# EAGLE design control-board (EAGLE 9.6.2)
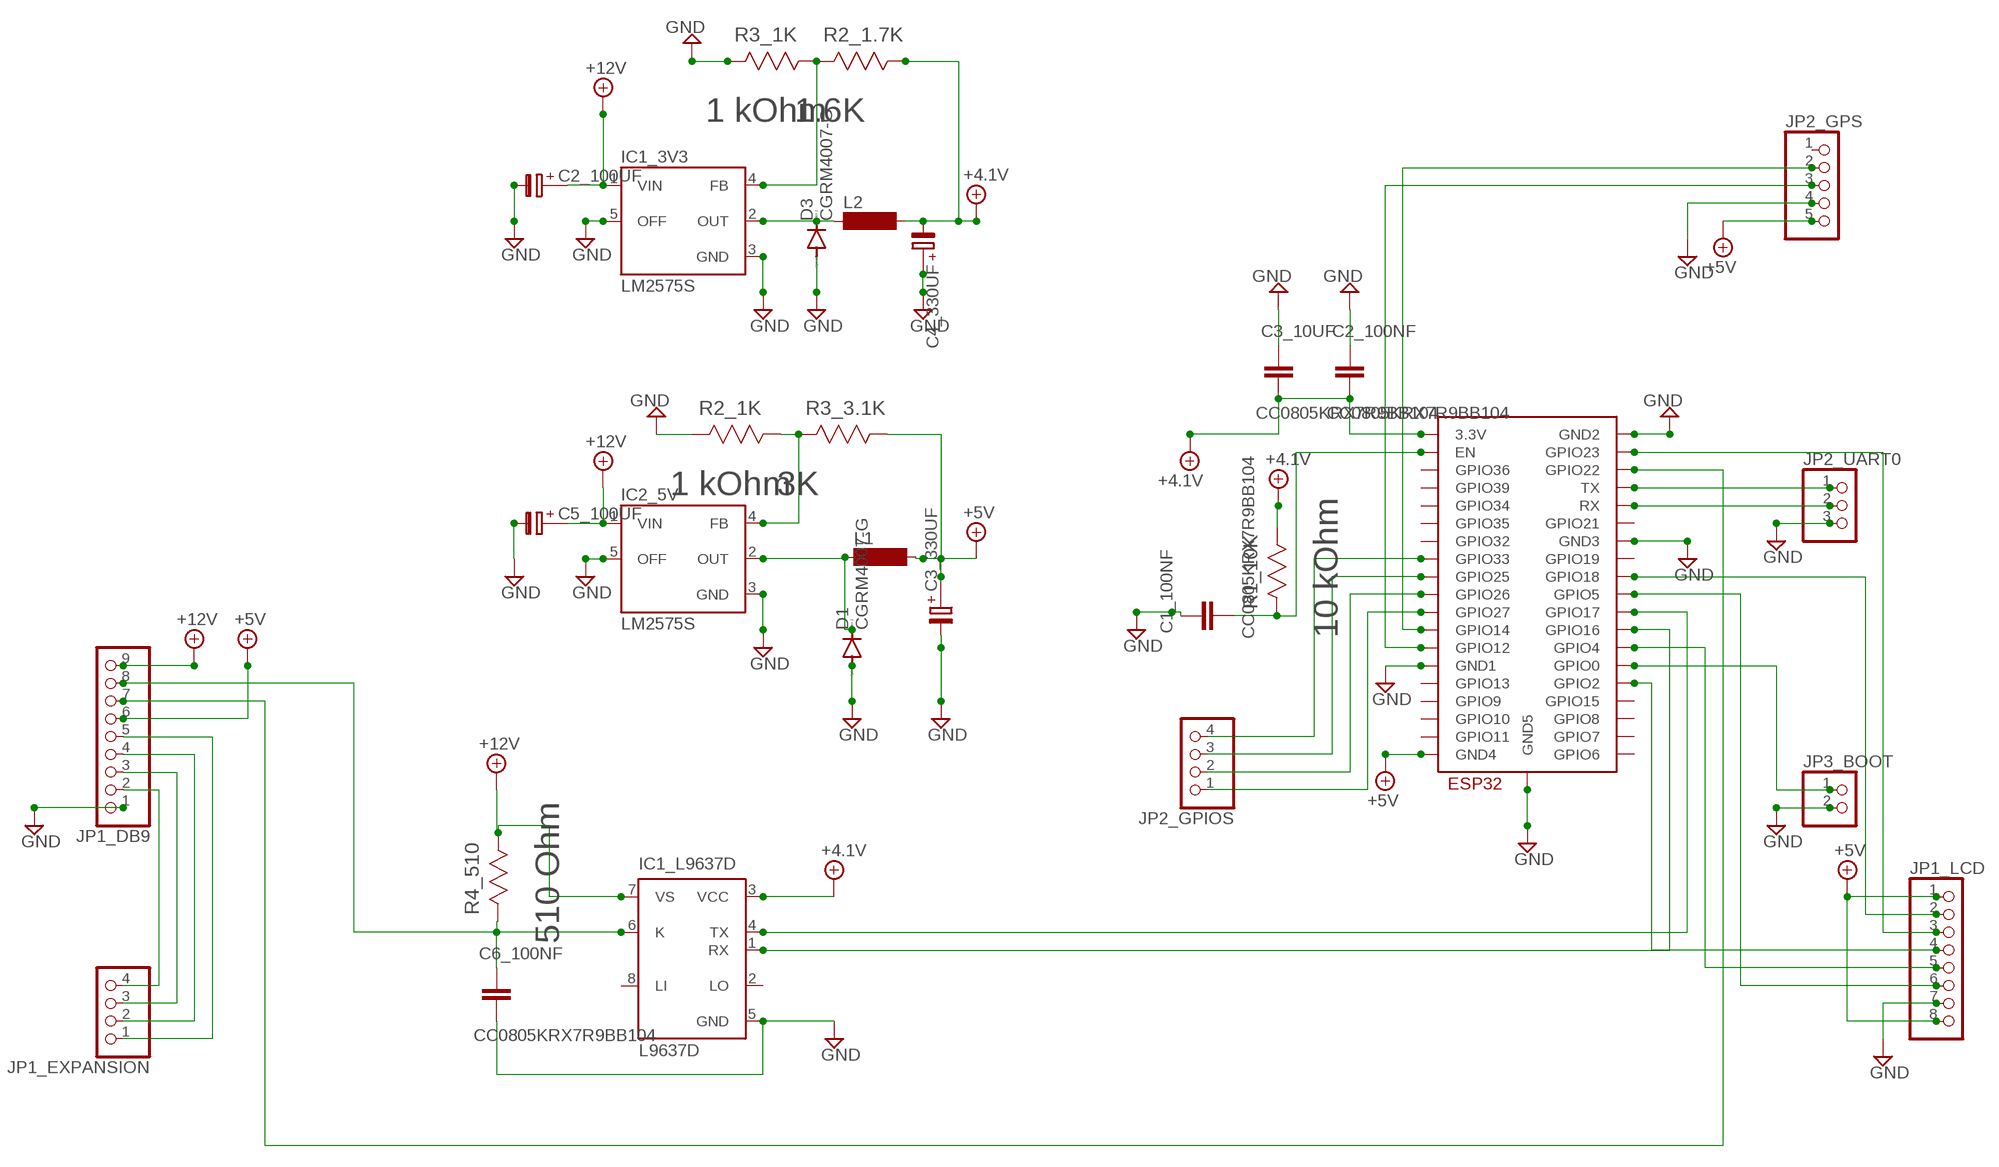
[diagram p0: schematic, sheet 1]

## Parts
C1_100NF  CC0805KRX7R9BB104  [CAP_0805]
C2_100NF  CC0805KRX7R9BB104  [CAP_0805]
C2_100UF  C-PR-SMD-SV-E/F  [SV-E/F]
C3_10UF  CC0805KRX7R9BB104  [CAP_0805]
C3_330UF  C-PR-SMD-SV-D  [SV-D]
C4_330UF  C-PR-SMD-SV-D  [SV-D]
C5_100UF  C-PR-SMD-SV-E/F  [SV-E/F]
C6_100NF  CC0805KRX7R9BB104  [CAP_0805]
D1  CGRM4007-G  [SOD-123_MINI-SMA]
D3  CGRM4007-G  [SOD-123_MINI-SMA]
ESP32  ESP32-WROOM  [ESP32-WROOM]
IC1_3V3  LM2575S  [TO263-5]
IC1_L9637D  L9637D  [SO08]
IC2_5V  LM2575S  [TO263-5]
JP1_DB9  PINHD-1X9/90  [1X09/90]
JP1_EXPANSION  PINHD-1X4/90  [1X04/90]
JP1_LCD  PINHD-1X8  [1X08]
JP2_GPIOS  PINHD-1X4/90  [1X04/90]
JP2_GPS  PINHD-1X5  [1X05]
JP2_UART0  PINHD-1X3/90  [1X03/90]
JP3_BOOT  PINHD-1X2/90  [1X02/90]
L1  MS85  [MS85]
L2  MS85  [MS85]
R1_10K  10 kOhm  ERA-6AEB103V  [RESC2013X65N]
R2_1.7K  1.6K  ERJP06F1601V  [RESC2013X65N]
R2_1K  1 kOhm  ERA-6AEB102V  [RESC2013X65N]
R3_1K  1 kOhm  ERA-6AEB102V  [RESC2013X65N]
R3_3.1K  3K  ERJP06F3001V  [RESC2013X65N]
R4_510  510 Ohm  ERA-6AEB511V  [RESC2013X65N]

## Nets
+4.1V: C2_100NF.2 C3_10UF.2 C4_330UF.- ESP32.3V3(3.3V) IC1_L9637D.3(VCC) L2.2 R1_10K.1(R1) R2_1.7K.1(R1)
+5V: C3_330UF.+ ESP32.GND4 JP1_DB9.6 JP1_LCD.1 JP1_LCD.8 JP2_GPS.5 L1.2 R3_3.1K.1(R1)
+12V: C2_100UF.+ C5_100UF.+ IC1_3V3.1(VIN) IC1_L9637D.7(VS) IC2_5V.1(VIN) JP1_DB9.9 R4_510.1(R1)
GND: C1_100NF.1 C2_100NF.1 C2_100UF.- C3_10UF.1 C3_330UF.- C4_330UF.+ C5_100UF.- C6_100NF.2 D1.A D3.A ESP32.GND1 ESP32.GND2 ESP32.GND3 ESP32.GND5 IC1_3V3.3(GND) IC1_3V3.5(OFF) IC1_L9637D.5(GND) IC2_5V.3(GND) IC2_5V.5(OFF) JP1_DB9.1 JP1_LCD.7 JP2_GPS.4 JP2_UART0.3 JP3_BOOT.2 R2_1K.2(R2) R3_1K.2(R2)
N$1: C1_100NF.2 ESP32.EN R1_10K.2(R2)
N$2: D3.C IC1_3V3.2(OUT) L2.1
N$3: C6_100NF.1 IC1_L9637D.6(K) JP1_DB9.8 R4_510.2(R2)
N$4: D1.C IC2_5V.2(OUT) L1.1
N$5: IC1_3V3.4(FB) R2_1.7K.2(R2) R3_1K.1(R1)
N$6: ESP32.IO0(GPIO0) JP3_BOOT.1
N$7: ESP32.TX JP2_UART0.1
N$8: ESP32.RX JP2_UART0.2
N$9: IC2_5V.4(FB) R2_1K.1(R1) R3_3.1K.2(R2)
N$10: ESP32.IO22(GPIO22) JP1_DB9.7
N$11: JP1_DB9.2 JP1_EXPANSION.4
N$12: ESP32.IO17(GPIO17) IC1_L9637D.4(TX)
N$13: ESP32.IO16(GPIO16) IC1_L9637D.1(RX)
N$14: ESP32.IO12(GPIO12) JP2_GPS.3
N$15: ESP32.IO14(GPIO14) JP2_GPS.2
N$16: JP1_DB9.3 JP1_EXPANSION.3
N$17: JP1_DB9.4 JP1_EXPANSION.2
N$18: JP1_DB9.5 JP1_EXPANSION.1
N$19: ESP32.IO5(GPIO5) JP1_LCD.6
N$20: ESP32.IO4(GPIO4) JP1_LCD.5
N$21: ESP32.IO2(GPIO2) JP1_LCD.4
N$22: ESP32.IO23(GPIO23) JP1_LCD.3
N$23: ESP32.IO18(GPIO18) JP1_LCD.2
N$24: ESP32.IO27(GPIO27) JP2_GPIOS.1
N$25: ESP32.IO26(GPIO26) JP2_GPIOS.2
N$26: ESP32.IO25(GPIO25) JP2_GPIOS.3
N$27: ESP32.IO33(GPIO33) JP2_GPIOS.4
Unconnected: ESP32.CLK(GPIO6) ESP32.CMD(GPIO11) ESP32.IO13(GPIO13) ESP32.IO15(GPIO15) ESP32.IO19(GPIO19) ESP32.IO21(GPIO21) ESP32.IO32(GPIO32) ESP32.IO34(GPIO34) ESP32.IO35(GPIO35) ESP32.SD0(GPIO7) ESP32.SD1(GPIO8) ESP32.SD2(GPIO9) ESP32.SD3(GPIO10) ESP32.SENSOR_VN(GPIO39) ESP32.SENSOR_VP(GPIO36) IC1_L9637D.2(LO) IC1_L9637D.8(LI) JP2_GPS.1

## Library data of the parts
C1_100NF C2_100NF C3_10UF C6_100NF = Resistor_Capacitor:CC0805KRX7R9BB104: CAP CER 0.1UF 50V X7R 0805 Manufacturer's datasheet <http://www.yageo.com/documents/recent/UPY-GPHC_X7R_6.3V-to-50V_18.pdf>; CREATED_BY: PCBLayout.com; DIGIKEY_PART_NUMBER: 311-1140-2-ND; MANUFACTURER: Yageo; MPN: CC0805KRX7R9BB104; PACKAGE: SMD 0805
C2_100UF C3_330UF C4_330UF C5_100UF = cap-pan40:C-PR: POLARIZED ELECTROLYTIC/TANTALUM
D1 D3 = diode:CGRM400*-G: Molded plasitc,JEDEC SOD-123/Mini SMA Source: Comchip CGRM4001-G.pdf
ESP32 = ESP32:ESP32-WROOM
IC1_3V3 IC2_5V = v-reg-3:LM2575: National Semiconductor <http://www.national.com> 1.0A "Simple Switcher"(c) 52kHz, Vout 1.23-37V (HV: 57V), Vin 40V (HV: 60V), 50µA standby current
IC1_L9637D = st-microelectronics:L9637D: ISO 9141 INTERFACE Source: 1765.pdf; MPN: L9637D; OC_FARNELL: unknown; OC_NEWARK: 56P8926
JP1_DB9 = pinhead:PINHD-1X9: PIN HEADER
JP1_EXPANSION JP2_GPIOS = pinhead:PINHD-1X4: PIN HEADER
JP1_LCD = pinhead:PINHD-1X8: PIN HEADER
JP2_GPS = pinhead:PINHD-1X5: PIN HEADER
JP2_UART0 = pinhead:PINHD-1X3: PIN HEADER
JP3_BOOT = pinhead:PINHD-1X2: PIN HEADER
L1 L2 = inductor-neosid:MS85: INDUCTOR SMD power inductor; OC_FARNELL: unknown; OC_NEWARK: unknown
R1_10K = Panasonic_By_element14_Batch_1:ERA-6AEB103V: RESISTOR, 0805; MPN: ERA-6AEB103V; OC_FARNELL: 1811404; OC_NEWARK: 08N2142; SUPPLIER: Panasonic; TOLERANCE: ±0.1 %; WATTAGE: 0.125 W
R2_1.7K = Panasonic_By_element14_Batch_1:ERJP06F1601V: RESISTOR, 0805; MPN: ERJP06F1601V; OC_FARNELL: 1894187; OC_NEWARK: 55T5739; SUPPLIER: Panasonic; TOLERANCE: ± 1%; WATTAGE: .25W
R2_1K R3_1K = Panasonic_By_element14_Batch_1:ERA-6AEB102V: RESISTOR, 0805; MPN: ERA-6AEB102V; OC_FARNELL: 1811415; OC_NEWARK: 08N2141; SUPPLIER: Panasonic; TOLERANCE: ±0.1 %; WATTAGE: 0.125 W
R3_3.1K = Panasonic_By_element14_Batch_1:ERJP06F3001V: RESISTOR, 0805; MPN: ERJP06F3001V; OC_FARNELL: 1894190; OC_NEWARK: 55T5754; SUPPLIER: Panasonic; TOLERANCE: ± 1%; WATTAGE: .25W
R4_510 = Panasonic_By_element14_Batch_1:ERA-6AEB511V: RESISTOR, 0805; MPN: ERA-6AEB511V; OC_FARNELL: 1670224; OC_NEWARK: 40P0028; SUPPLIER: Panasonic; TOLERANCE: ±0.1 %; WATTAGE: 0.125 W

## Board
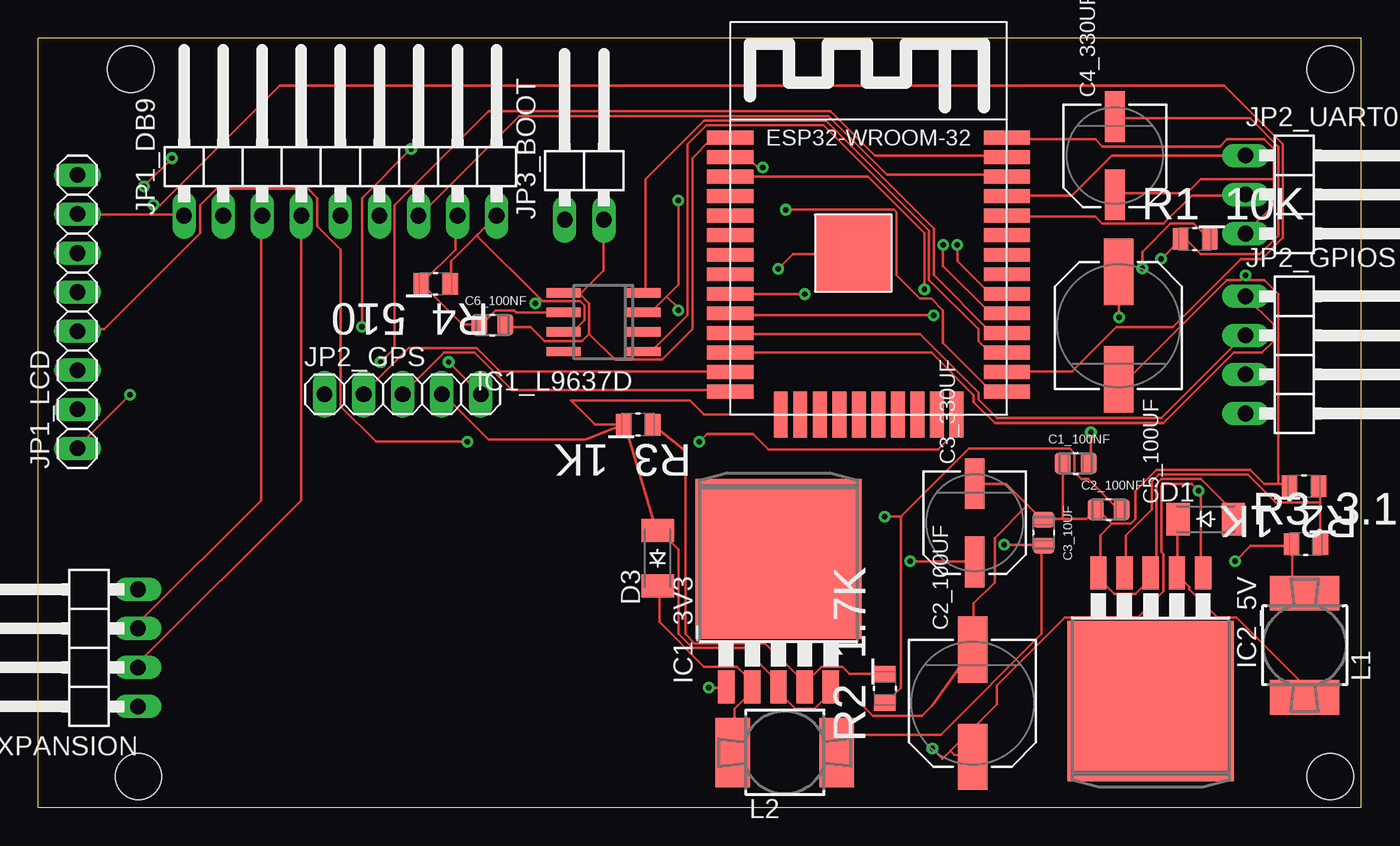
[diagram p1: board, top side]
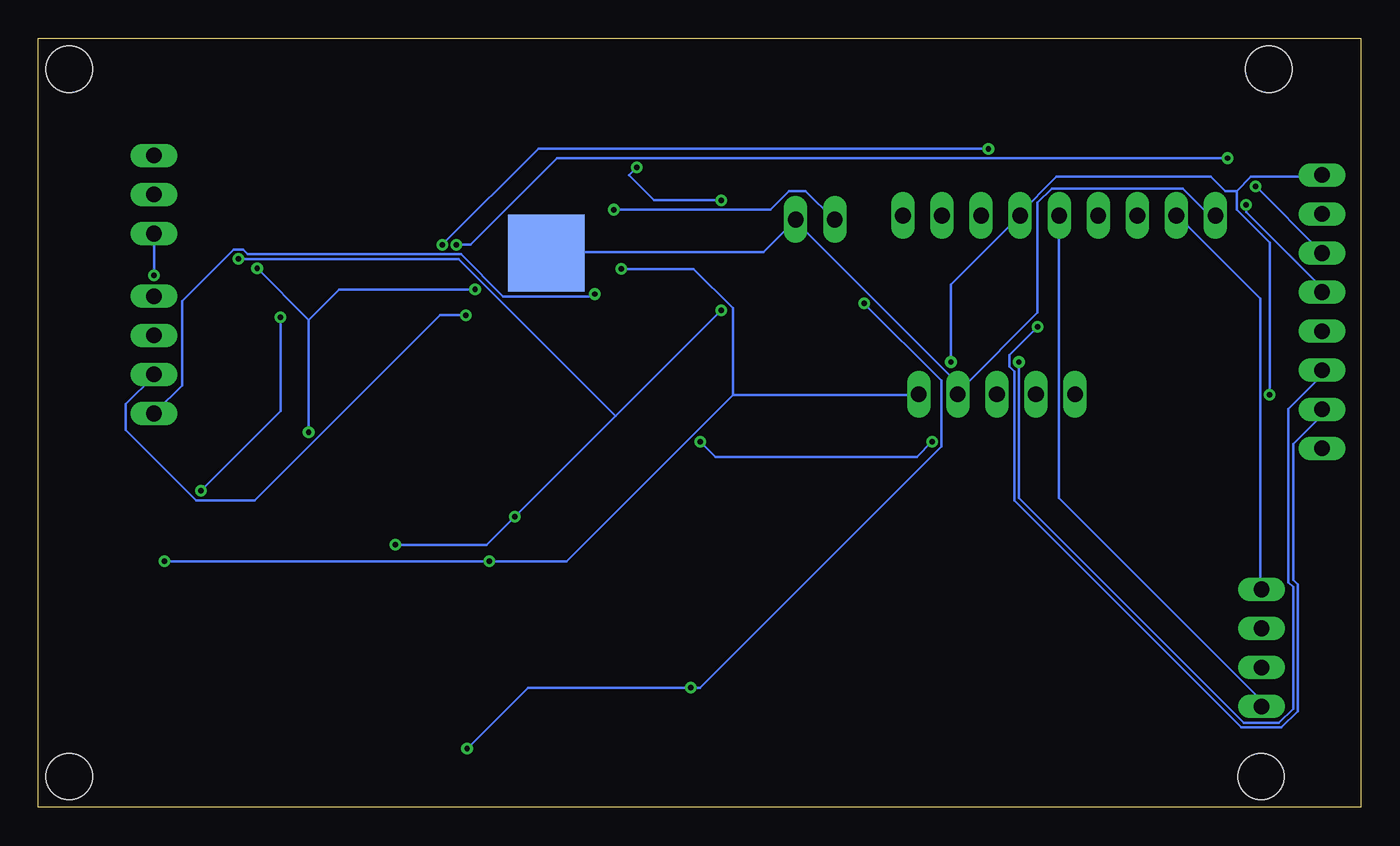
[diagram p2: board, bottom side, seen from below]

Size 86 x 50 mm. Coordinates in mm from the lower left corner, seen from the top.
Outline: 0,0 86,0 86,50 0,50 0,0
Copper layers (1*16): Top 0.035mm / dielectric 1.5mm / Bottom 0.035mm
Design rules "default": minimum track width 6mil, minimum drill 0.35mm, track to track 6mil, track to pad 6mil, pad to pad 6mil, via to via 6mil, smd to smd 6mil, copper to edge 40mil, drill to drill 6mil, minimum pad ring 10mil, minimum via ring 8mil, stop-mask expansion 4mil, vias tented up to drill 0mil, thermal gap 10mil
Holes 3 mm at 6,48 6.5,2 84,48 84,2

### Footprints (pad centres in the part's own frame; a part is rotated, then mirrored left to right if it is on the bottom)
CAP_0805 = smd 1.05 x 1.38: 1 -0.84,0; 2 0.84,0
SV-E/F = smd 4.318 x 1.93: + -3.493,0; - 3.493,0
SV-D = smd 3.302 x 1.27: + -2.54,0; - 2.54,0
SOD-123_MINI-SMA = smd 1.5 x 2.1: A 1.8,0; C -1.8,0
ESP32-WROOM = smd 3 x 0.9: 3V3 0,16.74; EN 0,15.47; GND1 0,18.01; GND3 18,18.01; IO0 18,1.5; IO4 18,2.77; IO5 18,6.58; IO12 0,1.5; IO14 0,2.77; IO16 18,4.04; IO17 18,5.31; IO18 18,7.85; IO19 18,9.12; IO21 18,11.66; IO22 18,15.47; IO23 18,16.74; IO25 0,6.58; IO26 0,5.31; IO27 0,4.04; IO32 0,9.12; IO33 0,7.85; IO34 0,11.66; IO35 0,10.39; NC 18,10.39; RX 18,12.93; SENSOR_VN 0,12.93; SENSOR_VP 0,14.2; TX 18,14.2 | smd 0.9 x 3: CLK 9.635,0; CMD 8.365,0; GND2 3.285,0; IO2 14.715,0; IO13 4.555,0; IO15 13.445,0; SD0 10.905,0; SD1 12.175,0; SD2 5.825,0; SD3 7.095,0 | smd 5 x 5: GND4 8,10.5 | smd 5 x 5 bottom: GND5 8,10.5
TO263-5 = smd 1.067 x 2.159: 1 -3.404,-5.791; 2 -1.702,-5.791; 3 0,-5.791; 4 1.702,-5.791; 5 3.404,-5.791 | smd 10.8 x 10.41: 6 0,2.54
SO08 = smd 0.6 x 2.2: 1 -1.905,-2.6; 2 -0.635,-2.6; 3 0.635,-2.6; 4 1.905,-2.6; 5 1.905,2.6; 6 0.635,2.6; 7 -0.635,2.6; 8 -1.905,2.6
1X09/90 = drill 1.016 long: 1 -10.16,-3.81; 2 -7.62,-3.81; 3 -5.08,-3.81; 4 -2.54,-3.81; 5 0,-3.81; 6 2.54,-3.81; 7 5.08,-3.81; 8 7.62,-3.81; 9 10.16,-3.81
1X04/90 = drill 1.016 long: 1 -3.81,-3.81; 2 -1.27,-3.81; 3 1.27,-3.81; 4 3.81,-3.81
1X08 = drill 1.016 long: 1 -8.89,0; 2 -6.35,0; 3 -3.81,0; 4 -1.27,0; 5 1.27,0; 6 3.81,0; 7 6.35,0; 8 8.89,0
1X05 = drill 1.016 long: 1 -5.08,0; 2 -2.54,0; 3 0,0; 4 2.54,0; 5 5.08,0
1X03/90 = drill 1.016 long: 1 -2.54,-3.81; 2 0,-3.81; 3 2.54,-3.81
1X02/90 = drill 1.016 long: 1 -1.27,-3.81; 2 1.27,-3.81
MS85 = smd 4.5 x 2.25: 1 0,-3.383; 2 0,3.383
RESC2013X65N = smd 1.016 x 1.397: 1 -0.94,0; 2 0.94,0

### Placement (x,y rotation side)
C1_100NF  67.44,22.36 0 top
C2_100NF  69.58,19.36 0 top
C2_100UF  60.74,6.77 90 top
C3_10UF  65.36,17.85 270 top
C3_330UF  60.88,18.5 90 top
C4_330UF  69.99,42.37 90 top
C5_100UF  70.23,31.32 270 top
C6_100NF  29.51,31.36 0 top
D1  75.9,18.74 0 top
D3  40.26,16.2 90 top
ESP32  44.98,25.54 0 top
IC1_3V3  48.12,13.62 0 top
IC1_L9637D  36.74,31.55 90 top
IC2_5V  72.32,9.44 180 top
JP1_DB9  19.63,42.29 0 top
JP1_EXPANSION  2.65,10.36 90 top
JP1_LCD  2.53,32.23 90 top
JP2_GPIOS  82.29,29.42 270 top
JP2_GPS  23.68,26.86 0 top
JP2_UART0  82.29,39.85 270 top
JP3_BOOT  35.49,42.03 0 top
L1  82.33,10.53 0 top
L2  48.53,3.56 270 top
R1_10K  75.2,36.96 0 top
R2_1.7K  55.04,7.73 90 top
R2_1K  82.29,20.88 180 top
R3_1K  38.99,24.88 180 top
R3_3.1K  82.41,17.12 0 top
R4_510  25.83,34.04 180 top

### Tracks (layer width: path | path; a pad name or v marks a point on that pad's centre or on a via)
+4.1V  (via drill 0.35)
  Top 0.152: L2.2 51.97,3.66 53.03,4.72 58.67,4.72 65.23,11.28 65.23,16.92 C3_10UF.2 65.23,17.07 v62.79,17.07 | C4_330UF.- 70.1,44.81 78.79,44.81 80.62,42.98 80.62,37.19 79.4,35.97 75.59,35.97 74.68,36.88 74.37,36.88 R1_10K.1 74.22,36.88 v73,35.66 | 40.84,33.22 41.6,33.98 v41.6,39.47 | 40.84,33.22 39.93,32.31 39.47,32.31 IC1_L9637D.3 | v47.09,41.6 46.79,41.6 46.18,42.22 45.11,42.22 ESP32.3V3 | 56.08,18.9 60.5,23.32 67.06,23.32 67.36,23.01 67.36,21.79 67.82,21.34 68.28,21.34 70.1,19.51 70.41,19.51 C2_100NF.2 | 56.08,18.9 56.08,7.77 55.17,6.86 R2_1.7K.1 | 40.84,33.22 41.6,32.46 v41.6,32.31 | 56.08,18.9 v55.02,18.9
  Bottom 0.152: v41.6,39.47 45.96,39.47 47.59,41.1 v47.09,41.6 | 48.46,25.45 v55.02,18.9 56.84,17.07 v62.79,17.07 | 48.46,25.45 v41.6,32.31 | v73,35.66 58.67,35.66 48.46,25.45
+5V  (via drill 0.35)
  Top 0.152: 81.53,17 81.53,14.78 82.3,14.02 L1.2 | 81.53,17 81.53,17.07 R3_3.1K.1 | v26.67,28.96 28.65,26.98 JP2_GPS.5 | v56.69,16 60.81,16 C3_330UF.+ | v77.81,16 78.81,17 81.53,17 | v48.09,35.01 49.05,35.97 52.88,35.97 ESP32.GND4 | v5.94,26.82 2.59,23.47 JP1_LCD.1
  Bottom 0.152: v26.67,28.96 26.67,33.98 22.25,38.41 JP1_DB9.6 22.25,38.56 19.81,41 9.75,41 8.84,40.08 8.08,40.08 | 40.84,26.82 51.66,16 v56.69,16 v77.81,16 | 40.84,26.82 28.8,26.82 JP2_GPS.5 | v48.09,35.01 43.39,35.01 40.84,32.46 40.84,26.82 | v5.94,26.82 5.94,36.73 8.08,38.86 8.08,40.08 | 8.08,40.08 7.16,41 2.59,41 JP1_LCD.8
+12V  (via drill 0.35)
  Top 0.152: 28.5,37.19 29.72,38.41 JP1_DB9.9 | 28.5,37.19 26.82,35.51 26.82,34.14 R4_510.1 | 28.5,37.19 32.61,33.07 | 32.61,33.07 32.77,32.92 35.2,32.92 35.51,32.61 35.51,31.7 34.75,30.94 34.29,30.94 IC1_L9637D.7 | v43.59,7.77 44.65,7.77 IC1_3V3.1 | 59.28,3.66 59.54,3.4 C2_100UF.+ | 59.28,3.66 58.78,3.16 v58.13,3.81 | 59.28,3.66 62.33,6.71 62.33,7.92 66.75,12.34 71.48,12.34 73.15,14.02 73.15,16.46 73,16.61 73,20.88 73.15,21.03 74.98,21.03 v75.44,20.57 75.59,20.42 75.59,15.24 IC2_5V.1 | v70.26,31.85 70.26,34.75 C5_100UF.+ | v32.31,32.77 32.61,33.07
  Bottom 0.152: v58.13,3.81 54.17,7.77 v43.59,7.77 42.98,7.77 27.28,23.47 27.28,27.74 v32.31,32.77 | v70.26,31.85 70.26,25.76 v75.44,20.57
GND  (via drill 0.35)
  Top 0.152: 80.31,40.84 80.31,39.17 78.49,37.34 JP2_UART0.3 | 80.31,40.84 80.31,42.82 79.7,43.43 77.27,43.43 76.81,42.98 69.19,42.98 68.73,43.43 63.09,43.43 ESP32.GND3 | 80.31,40.84 75.59,40.84 74.68,39.93 70.1,39.93 C4_330UF.+ | D1.A 76.94,19.5 77.11,19.81 75.59,21.34 73,21.34 72.69,21.03 72.69,15.54 72.39,15.24 IC2_5V.3 72.24,15.09 72.24,14.78 71.32,13.87 69.95,13.87 69.04,14.78 69.04,15.09 IC2_5V.5 69.04,15.24 69.04,17.68 69.8,18.44 | 66.6,18.75 68.12,18.75 C2_100NF.1 68.89,19.36 69.8,18.44 | 66.6,18.75 65.38,18.75 C3_10UF.1 65.23,18.75 64.31,19.66 | 66.6,18.75 66.6,22.25 C1_100NF.1 | 80.62,21.03 79.7,21.03 78.79,21.95 72.69,21.95 71.32,20.57 71.32,18.75 71.02,18.44 69.8,18.44 | 80.62,21.03 81.23,21.03 R2_1K.2 | 64.31,19.66 62.94,21.03 60.96,21.03 C3_330UF.- | 80.62,21.03 80.62,33.38 79.7,34.29 78.49,34.29 78.33,34.44 | C5_100UF.- 70.26,27.89 70.87,27.89 77.27,34.29 78.18,34.29 78.33,34.44 | 64.31,19.66 62.18,17.53 62.18,14.63 60.81,13.26 60.81,10.3 C2_100UF.- 58.14,6.63 57.45,5.94 54.25,5.94 52.43,7.77 51.66,7.77 IC1_3V3.5 51.51,7.77 51.51,7.47 50.44,6.4 49.23,6.4 48.16,7.47 48.16,7.77 IC1_3V3.3 48.01,7.92 48.01,8.23 45.87,10.36 42.52,10.36 41.6,11.28 41.6,16.76 40.39,17.98 D3.A 40.23,18.14 40.08,18.29 38.19,24.74 R3_1K.2 | 35.81,30.79 35.36,30.33 32.92,30.33 32,31.24 30.48,31.24 C6_100NF.2 | 35.81,30.79 35.81,32.77 35.2,33.38 | 35.2,33.38 34.29,33.38 IC1_L9637D.5 35.2,33.38 | 35.81,30.79 37.49,29.11 40.54,29.11 42.52,31.09 42.52,42.22 43.74,43.43 44.96,43.43 ESP32.GND1 | 35.2,33.38 36.73,34.9 36.73,38.1 JP3_BOOT.2 | ESP32.GND2 43.27,25.54 42.35,26.45 34.62,26.45 36.19,24.88 R3_1K.2
  Top 0.152: JP2_GPS.4 26.36,26.82 29.26,23.93 35.58,23.93 R3_1K.2 | JP1_LCD.7 2.59,38.56 9.45,38.56 JP1_DB9.1 | 78.33,34.44 v78.49,34.59
  Bottom 0.152: v78.49,34.59 78.49,37.19 JP2_UART0.3 | ESP32.GND5 52.88,36.12 38.86,36.12 36.88,38.1 JP3_BOOT.2 36.73,38.1 25.91,27.28 | 2.59,38.56 JP1_LCD.7 | 9.45,38.56 JP1_DB9.1 9.6,38.56 9.91,38.56 11.58,40.23 20.12,40.23 21.03,39.32 21.03,32.16 25.91,27.28 | 25.91,27.28 26.21,26.98 JP2_GPS.4 25.91,27.28
N$1  (via drill 0.35)
  Top 0.152: v68.43,24.38 68.43,22.4 C1_100NF.2 | v71.78,35.05 71.78,36.12 73.61,37.95 75.13,37.95 76.05,37.03 R1_10K.2 | v57.61,33.68 57.61,37.34 53.95,41 45.11,41 ESP32.EN
  Bottom 0.152: 68.43,31.7 v68.43,24.38 | v71.78,35.05 68.43,31.7 | v57.61,33.68 66.45,33.68 68.43,31.7
N$2
  Top 0.152: D3.C 40.39,14.33 40.39,12.04 43.28,9.14 45.41,9.14 46.33,8.23 46.33,7.92 IC1_3V3.2 46.33,7.77 46.33,7.47 45.26,6.4 45.26,3.66 L2.1
N$3
  Top 0.152: IC1_L9637D.6 34.14,32.16 31.09,32.16 30.94,32.31 29.72,32.31 28.8,31.39 C6_100NF.1 28.65,31.39 27.58,31.39 24.99,33.98 R4_510.2 24.99,34.14 27.13,36.27 27.13,38.41 JP1_DB9.8
N$4
  Top 0.152: D1.C 74.07,18.66 74.07,15.24 IC2_5V.2 74.07,15.09 74.83,14.33 74.83,14.17 76.66,12.34 77.88,12.34 82.3,7.92 82.3,7.16 L1.1
N$5
  Top 0.152: 49.84,8.08 49.68,7.92 IC1_3V3.4 49.84,8.08 | 49.84,8.08 50.9,9.14 52.27,9.14 52.73,8.69 55.02,8.69 R2_1.7K.2 | 49.84,8.08 47.24,10.67 42.67,10.67 42.06,11.28 42.06,23.18 R3_1K.1
N$6  (via drill 0.35)
  Top 0.152: v48.59,38.86 55.63,38.86 55.78,38.71 55.78,34.59 57.3,33.07 58.06,33.07 58.83,32.31 58.83,30.18 61.87,27.13 62.94,27.13 ESP32.IO0
  Bottom 0.152: v48.59,38.86 38.41,38.86 37.19,40.08 36.12,40.08 34.29,38.25 JP3_BOOT.1
N$7
  Top 0.152: ESP32.TX 63.09,39.78 67.21,39.78 69.8,42.37 78.33,42.37 JP2_UART0.1
N$8
  Top 0.152: ESP32.RX 63.09,38.41 68.73,38.41 69.19,37.95 73.15,37.95 74.98,39.78 78.33,39.78 JP2_UART0.2
N$9
  Top 0.152: 83.36,19.81 83.36,20.88 R2_1K.1 | 83.36,19.81 83.36,17.22 R3_3.1K.2 | 83.36,19.81 80.47,19.81 78.64,21.64 72.85,21.64 72.39,21.18 72.39,19.36 70.71,17.68 70.71,15.24 IC2_5V.4
N$10
  Top 0.152: ESP32.IO22 62.94,41.15 55.17,41.15 51.36,44.96 31.24,44.96 24.84,38.56 JP1_DB9.7
N$11
  Bottom 0.152: JP1_EXPANSION.4 6.55,14.17 6.55,33.07 11.89,38.41 JP1_DB9.2
N$12
  Top 0.152: IC1_L9637D.4 39.47,33.53 39.47,40.84 43.28,44.65 51.21,44.65 58.22,37.64 58.22,34.59 61.87,30.94 62.94,30.94 ESP32.IO17
N$13
  Top 0.152: IC1_L9637D.1 39.47,29.72 39.93,29.72 42.22,32 42.22,43.13 43.43,44.35 51.05,44.35 57.91,37.49 57.91,34.29 61.11,31.09 61.11,30.33 61.72,29.72 62.94,29.72 ESP32.IO16
N$14
  Top 0.152: ESP32.IO12 44.96,27.13 30.79,27.13 28.35,29.57 26.36,29.57 23.77,26.98 JP2_GPS.3
N$15
  Top 0.152: ESP32.IO14 44.96,28.35 30.02,28.35 28.5,29.87 24.08,29.87 21.18,26.98 JP2_GPS.2
N$16
  Top 0.152: JP1_EXPANSION.3 6.55,11.73 6.55,12.04 14.48,19.96 14.48,38.41 JP1_DB9.3
N$17
  Top 0.152: JP1_EXPANSION.2 6.55,9.14 6.55,9.45 17.07,19.96 17.07,38.41 JP1_DB9.4
N$18
  Bottom 0.152: JP1_EXPANSION.1 6.55,6.55 6.55,7.01 19.66,20.12 19.66,38.41 JP1_DB9.5
N$19  (via drill 0.35)
  Top 0.152: v58.83,36.58 58.83,35.2 61.87,32.16 62.94,32.16 ESP32.IO5 | v8.69,42.22 v6.86,40.39
  Bottom 0.152: v58.83,36.58 57.91,36.58 52.27,42.22 v8.69,42.22 | v6.86,40.39 2.59,36.12 JP1_LCD.6
N$20  (via drill 0.35)
  Top 0.152: ESP32.IO4 63.09,28.35 67.21,28.35 70.1,31.24 73.76,31.24 78.18,35.66 79.55,35.66 80.92,37.03 80.92,43.13 77.11,46.94 15.7,46.94 7.92,39.17 v7.47,39.17 | 2.34,33.59 JP1_LCD.5
  Bottom 0.152: v7.47,39.17 7.47,38.71 2.59,33.83 2.59,33.53 JP1_LCD.5
N$21  (via drill 0.35)
  Top 0.152: v42.98,23.77 43.48,24.27 46.48,24.27 47.48,23.27 58.48,23.27 59.59,24.38 59.59,25.45 ESP32.IO2 | v27.89,23.77 21.95,23.77 19.66,26.06 19.66,36.27 18.14,37.8 18.14,39.62 17.53,40.23 11.58,40.23 10.52,39.17 10.52,37.34 4.27,31.09 2.59,31.09 JP1_LCD.4
  Bottom 0.152: v27.89,23.77 28.89,22.77 41.98,22.77 v42.98,23.77
N$22  (via drill 0.35)
  Top 0.152: v22.25,28.96 23.16,29.87 23.16,39.17 29.26,45.26 51.51,45.26 54.41,42.37 62.94,42.37 ESP32.IO23
  Bottom 0.152: v22.25,28.96 22.25,20.12 7.62,5.49 5.33,5.49 4.42,6.4 4.42,14.33 4.72,14.63 4.72,25.91 2.59,28.04 2.59,28.35 JP1_LCD.3
N$23  (via drill 0.35)
  Top 0.152: v59.74,36.58 59.74,35.51 61.72,33.53 62.94,33.53 ESP32.IO18 | v21.03,31.24 21.03,39.62 v24.23,42.82
  Bottom 0.152: v59.74,36.58 53.49,42.82 v24.23,42.82 | 2.44,25.91 JP1_LCD.2 2.59,25.76 2.59,25.45 4.42,23.62 4.42,14.78 4.12,14.48 4.12,6.25 5.18,5.18 7.77,5.18 22.55,19.96 22.55,28.35 22.86,28.65 22.86,29.41 v21.03,31.24
N$24
  Top 0.152: ESP32.IO27 45.11,29.57 58.06,29.57 60.81,26.82 60.81,26.36 62.18,24.99 73.15,24.99 77.72,29.57 79.55,29.57 80.31,30.33 80.31,31.39 JP2_GPIOS.1
N$25
  Top 0.152: ESP32.IO26 45.11,30.79 57.3,30.79 61.11,26.98 61.11,26.52 62.33,25.3 73,25.3 78.33,30.63 JP2_GPIOS.2
N$26  (via drill 0.35)
  Top 0.152: v58.22,32 45.11,32 ESP32.IO25
  Bottom 0.152: v58.22,32 59.89,32 71.93,19.96 75.74,19.96 80.31,24.54 80.31,26.21 78.49,28.04 JP2_GPIOS.3
N$27  (via drill 0.35)
  Top 0.152: v49.84,33.38 45.11,33.38 ESP32.IO33
  Bottom 0.152: v49.84,33.38 49.84,33.22 55.78,33.22 58.52,35.97 72.39,35.97 72.69,36.27 73.3,36.27 76.66,32.92 76.66,27.43 78.33,25.76 JP2_GPIOS.4